# Altium schematic sheet testing_stuff.SchDoc
size A4; SheetNumber: 2; SheetTotal: 2
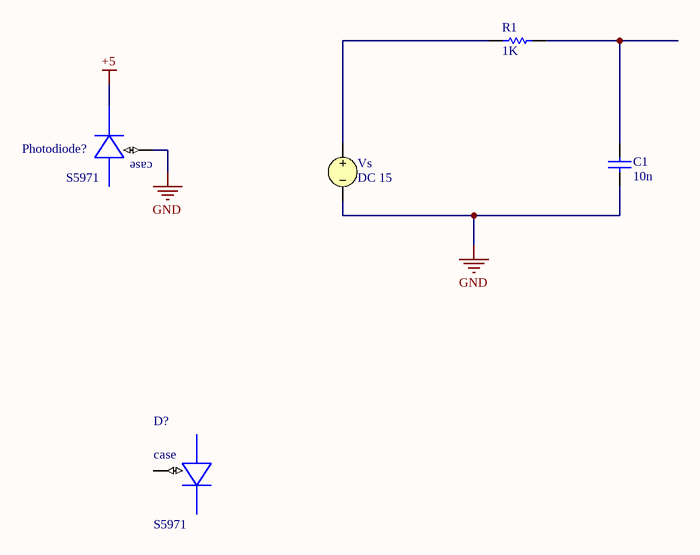
[diagram p0: testing_stuff.SchDoc]

## Parts
C1  value 10n  (hidden comment: Capacitor)
D?  S5971  [S5971-CASE]
Photodiode?  S5971  [S5971-CASE]
R1  value 1K  (hidden comment: Resistor)
Vs  DC 15

## Nets
+5: Photodiode?.P$1(CATHODE)
GND: C1.1 Photodiode?.P$2(CASE) Vs.2
NetC1_2: C1.2 R1.1
NetR1_2: R1.2 Vs.1

Not connected (* = marked no-connect by the designer): D? P$1(CATHODE) P$2(CASE) P$3(ANODE); Photodiode? P$3(ANODE)

## Notes on the sheet
- (in symbol S5971) case

## Library data of the parts
C1 = Capacitor: SimulationGenericComponent: True
D? Photodiode? = S5971: Heat Shrink Tubing, Semi Rigid 0.250 _6.35mm_ 2 to 1 White; MF: TE Connectivity; Price: None; Value: *; TE_purchase_URL: https://www.te.com/usa-en/product-S5971.html?te_bu=Cor&te_type=disp&te_campaign=seda_glo_cor-seda-global-disp-prtnr-fy19-seda-model-bom-cta_sma-317_1&elqCampaignId=32493; Availability: Unavailable; SnapEDA_Link: https://www.snapeda.com/parts/S5971/TE%20Connectivity%20Raychem%20Cable%20Protection/view-part/378018/?ref=snap; MP: S5971; Package: TO-18 Hamamatsu
R1 = Resistor: TC1: 0; SimulationGenericComponent: True; TC2: 0
Vs = VSRC: Voltage Source; Note: PCB Footprint - Not required; AC Magnitude: 5; AC Phase: 0; Value: 15; Published: 8-Jun-2000; LatestRevisionDate: 17-Jul-2002; LatestRevisionNote: Re-released for DXP Platform.; PackageReference: Not Applicable; Publisher: Altium Limited